# Altium schematic sheet RS232.SchDoc
size A
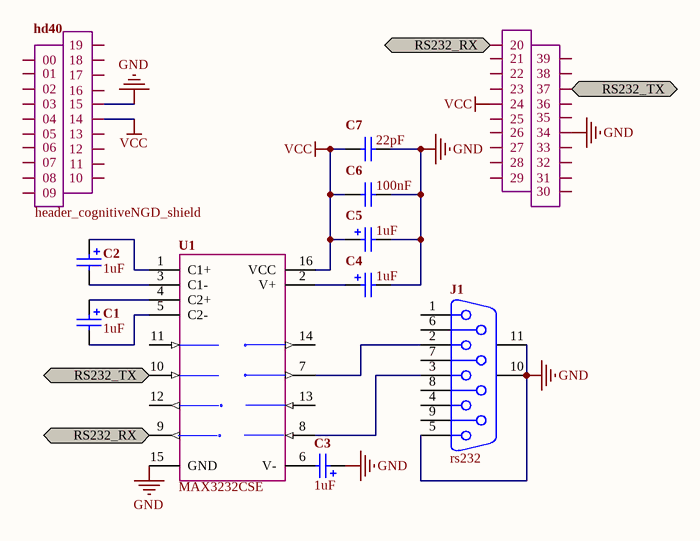
[diagram p0: RS232.SchDoc]

## Parts
C1  value 1uF  [0603[1608] pol]  (hidden comment: Cap Pol)
C2  value 1uF  [0603[1608] pol]  (hidden comment: Cap Pol)
C3  value 1uF  [0603[1608] pol]  (hidden comment: Cap Pol)
C4  value 1uF  [0603[1608] pol]  (hidden comment: Cap Pol)
C5  value 1uF  [0603[1608] pol]  (hidden comment: Cap Pol)
C6  value 100nF  [1608[0603]]  (hidden comment: Cap)
C7  value 22pF  [1608[0603]]  (hidden comment: Cap)
hd40  header_cognitiveNGD_shield  [header_cognitiveNGD_longlegs]
J1  rs232  [DSUB1.385-2H9]
U1  MAX3232CSE  [NSO16_N]

## Ports
RS232_RX, RS232_TX

## Nets
GND: C3.1 C4.2 C5.2 C6.2 C7.2 hd40.15 hd40.34 J1.5 J1.10(MH1) J1.11(MH2) U1.15(GND)
VCC: C5.1 C6.1 C7.1 hd40.14 hd40.24 U1.16(VCC)
RS232_RX: hd40.20 U1.9(R2OUT) ; port RS232_RX
RS232_TX: hd40.37 U1.10(T2IN) ; port RS232_TX
NetC1_1: C1.1 U1.4(C2+)
NetC1_2: C1.2 U1.5(C2-)
NetC2_1: C2.1 U1.1(C1+)
NetC2_2: C2.2 U1.3(C1-)
NetC3_2: C3.2 U1.6(V-)
NetC4_1: C4.1 U1.2(V+)
NetJ1_2: J1.2 U1.7(T2OUT)
NetJ1_3: J1.3 U1.8(R2IN)

Not connected (* = marked no-connect by the designer): hd40 00 01 02 03 04 05 06 07 08 09 10 11 12 13 16 17 18 19 21 22 23 25 26 27 28 29 30 31 32 33 35 36 38 39; J1 1 4 6 7 8 9; U1 11(T1IN) 12(R1OUT) 13(R1IN) 14(T1OUT)

## Library data of the parts
C1-C5 = Cap Pol: Polarized Capacitor (Surface Mount); Manufacturer: Generic Components; Class: Passive; Published: 08/06/2000; Publisher: Altium Hobart Technology Centre; SubClass: Capacitor
C6 C7 = Cap: Capacitor; Published: 8-Jun-2000; LatestRevisionDate: 17-Jul-2002; LatestRevisionNote: Re-released for DXP Platform.; PackageReference: RAD-0.3; Publisher: Altium Limited; PackageDescription: Radial Cap, Thru-Hole; 2 Leads; 0.3 in Pin Spacing
hd40 = header_cognitiveNGD
J1 = D Connector 9: Receptacle Assembly, 9 Position, Right Angle; PackageDocument: O; Positions: 9; Published: 15-Jun-2001; LatestRevisionDate: 17-Jul-2002; LatestRevisionNote: Re-released for DXP Platform.; DatasheetDocument: 1-Sep-1999; PackageReference: 788750; Publisher: Altium Limited; Orientation: Right Angle; Gender: Receptacle
U1 = MAX3232CSE: 3.0V TO 5.5V, Low-Power, up to 1Mbps, True RS-232 Transceiver Using Four 0.1µF External Capacitor; Published: 16-Jan-2001; LatestRevisionDate: 13-Apr-2006; LatestRevisionNote: IPC-7351 Footprint Added.; DatasheetVersion: Mar-1999; PackageReference: NSO16; Publisher: Altium Limited; PackageDescription: 16-Pin Small Outline Integrated Circuit 1.27 mm Pitch; Code_JEDEC: MS-012-AC; Code_IPC: SOIC127P600-16; ComponentLink1Description: Manufacturer Link; ComponentLink1URL: http://www.maxim-ic.com/; ComponentLink2Description: Datasheet; ComponentLink2URL: http://pdfserv.maxim-ic.com/en/ds/MAX3222-MAX3241.pdf